# EAGLE design mm5833 (EAGLE 9.6.2)
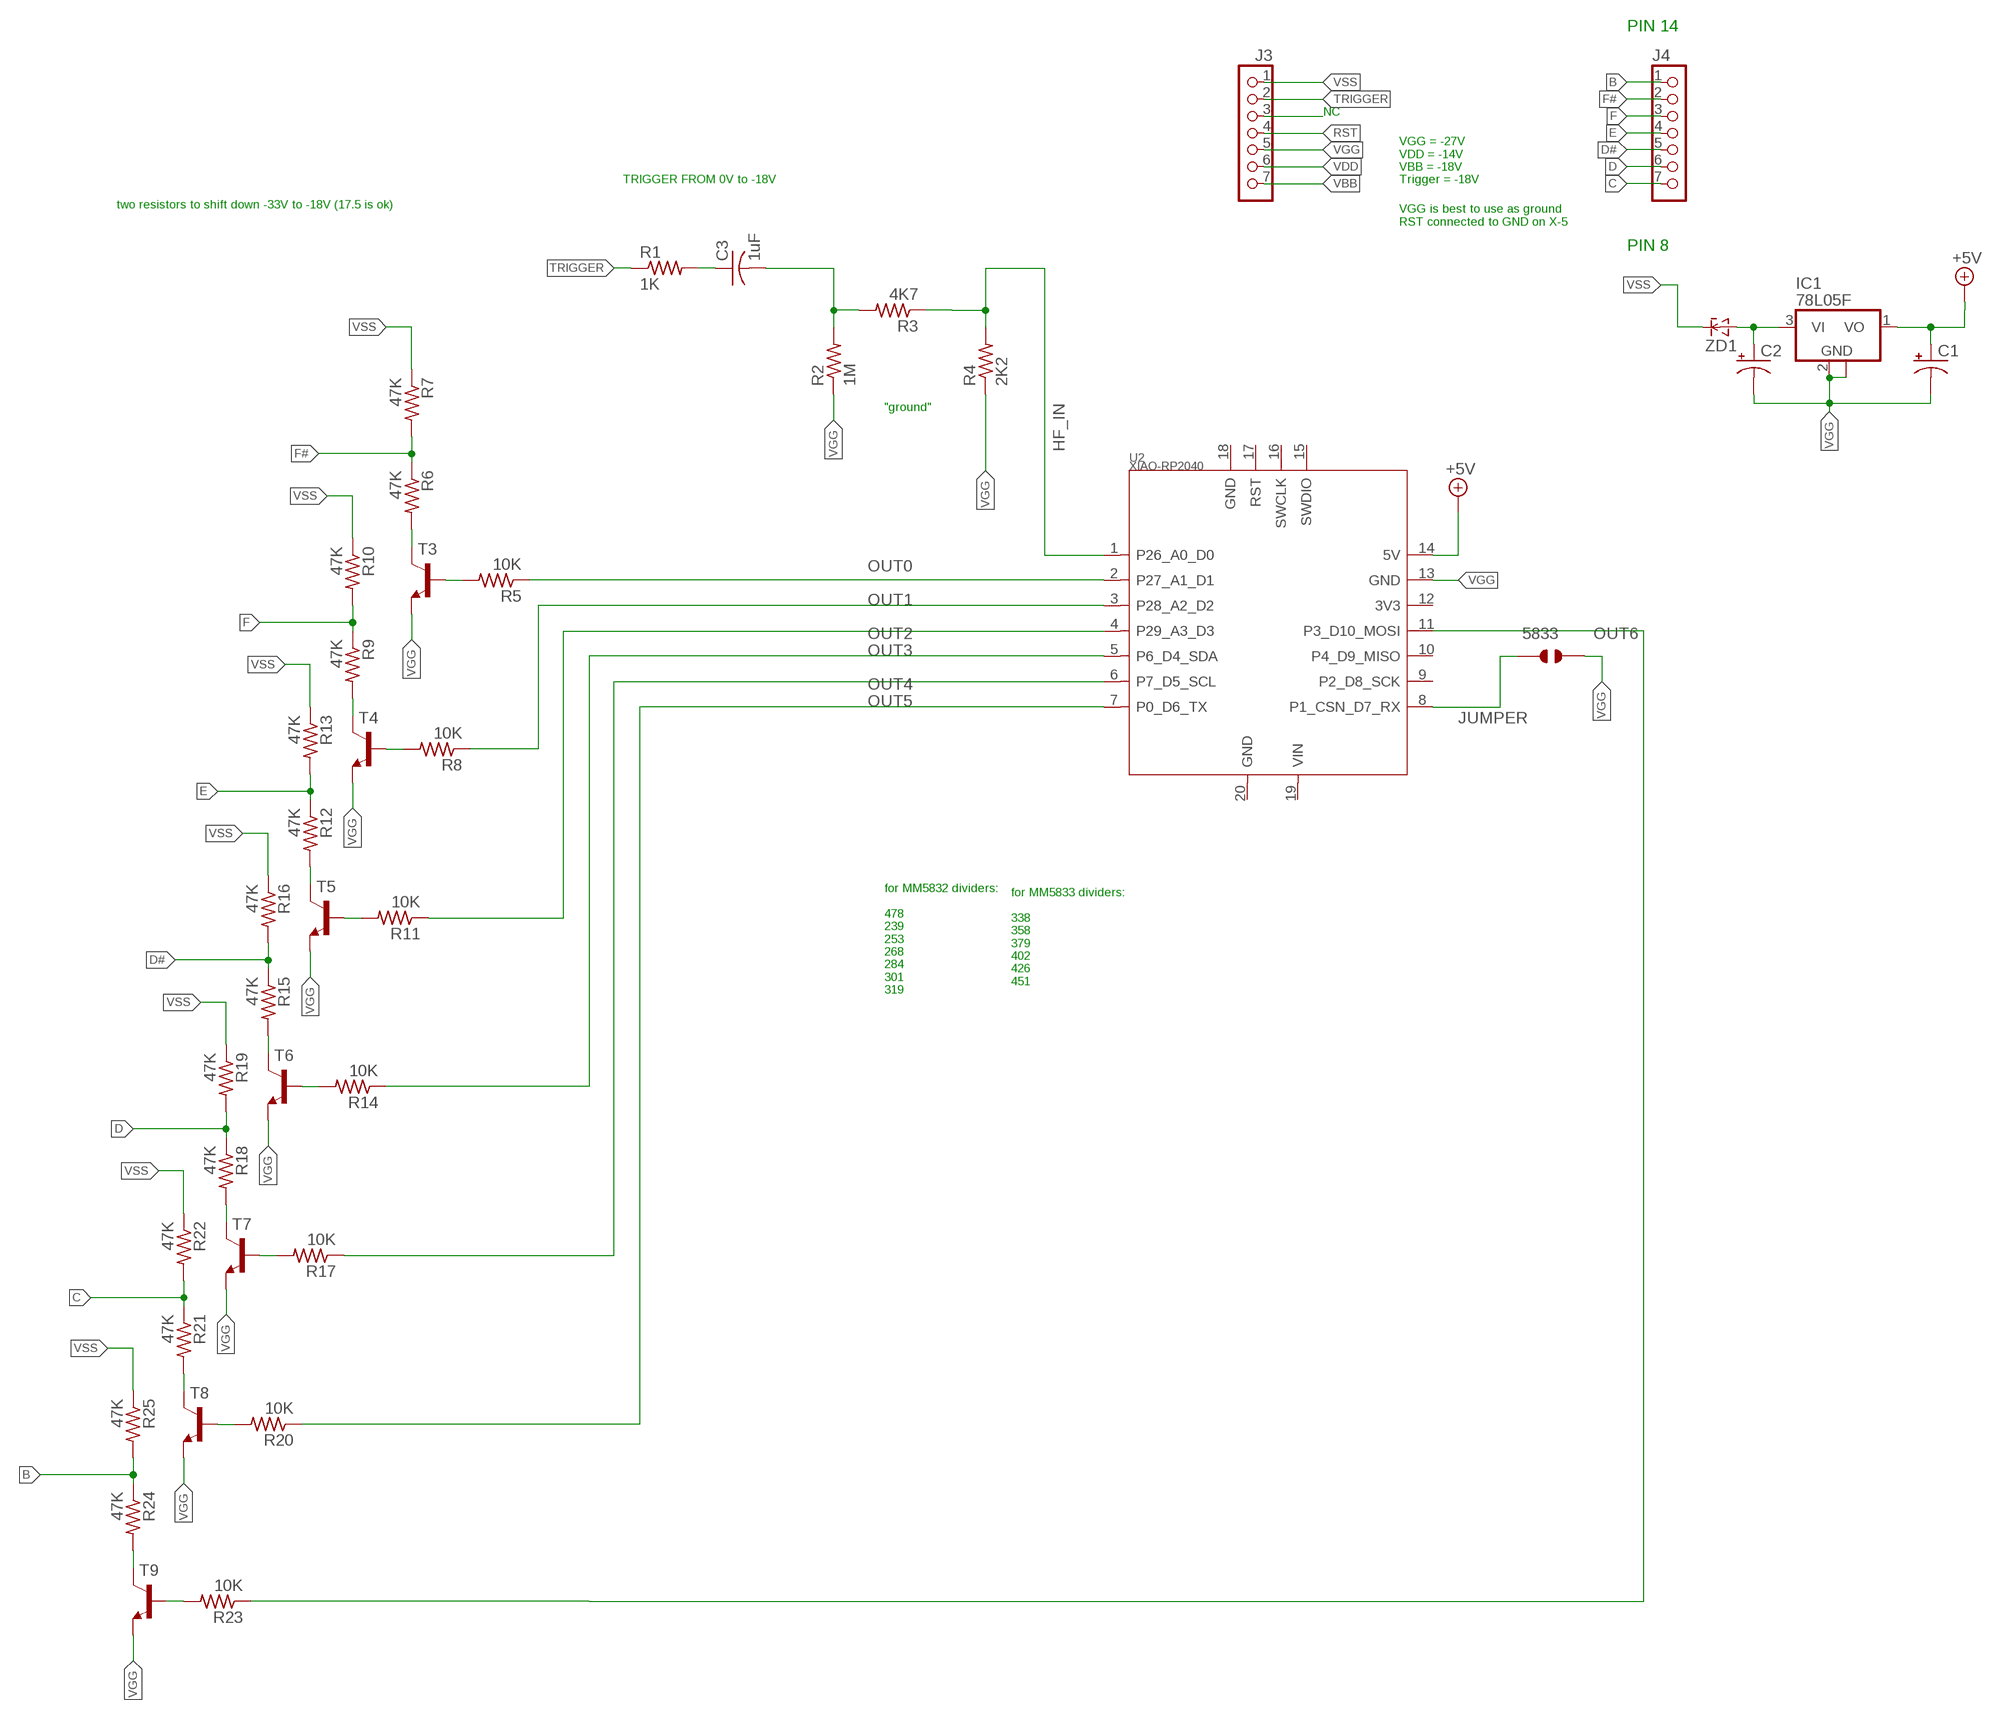
[diagram p0: schematic, sheet 1]

## Parts
5833  JUMPER_SOLDER_1X2  [JUMPER_SOLDER_1X2]
C1  CPOL-USA/3216-18R  [A/3216-18R]
C2  CPOL-USA/3216-18R  [A/3216-18R]
C3  1uF  C-USC0805  [C0805]
IC1  78L05F  [SOT89]
J3  CON_HEADER_1X07  [M1X7_SMD]
J4  CON_HEADER_1X07  [M1X7_SMD]
R1  1K  R-US_R0603  [R0603]
R2  1M  R-US_R0603  [R0603]
R3  4K7  R-US_R0603  [R0603]
R4  2K2  R-US_R0603  [R0603]
R5  10K  R-US_R0603  [R0603]
R6  47K  R-US_R0603  [R0603]
R7  47K  R-US_R0603  [R0603]
R8  10K  R-US_R0603  [R0603]
R9  47K  R-US_R0603  [R0603]
R10  47K  R-US_R0603  [R0603]
R11  10K  R-US_R0603  [R0603]
R12  47K  R-US_R0603  [R0603]
R13  47K  R-US_R0603  [R0603]
R14  10K  R-US_R0603  [R0603]
R15  47K  R-US_R0603  [R0603]
R16  47K  R-US_R0603  [R0603]
R17  10K  R-US_R0603  [R0603]
R18  47K  R-US_R0603  [R0603]
R19  47K  R-US_R0603  [R0603]
R20  10K  R-US_R0603  [R0603]
R21  47K  R-US_R0603  [R0603]
R22  47K  R-US_R0603  [R0603]
R23  10K  R-US_R0603  [R0603]
R24  47K  R-US_R0603  [R0603]
R25  47K  R-US_R0603  [R0603]
T3  MMBT3904LT1-NPN-SOT23-BEC  [SOT23-BEC]
T4  MMBT3904LT1-NPN-SOT23-BEC  [SOT23-BEC]
T5  MMBT3904LT1-NPN-SOT23-BEC  [SOT23-BEC]
T6  MMBT3904LT1-NPN-SOT23-BEC  [SOT23-BEC]
T7  MMBT3904LT1-NPN-SOT23-BEC  [SOT23-BEC]
T8  MMBT3904LT1-NPN-SOT23-BEC  [SOT23-BEC]
T9  MMBT3904LT1-NPN-SOT23-BEC  [SOT23-BEC]
U2  XIAO-RP2040  [XIAO-SAMD21/RP2040-MODULE14P-2.54-21X17.8MM]
ZD1  ZENERSOD-123  [SOD-123]

## Nets
+5V: C1.+ IC1.1(VO) U2.14(5V)
B: J4.1 R24.1 R25.2
C: J4.7 R21.1 R22.2
D: J4.6 R18.1 R19.2
D#: J4.5 R15.1 R16.2
E: J4.4 R12.1 R13.2
F: J4.3 R9.1 R10.2
F#: J4.2 R6.1 R7.2
HF_IN: R3.1 R4.2 U2.1(P26_A0_D0)
JUMPER: 5833.1 U2.8(P1_CSN_D7_RX)
N$1: C2.+ IC1.3(VI) ZD1.A
N$2: C3.1 R1.2
N$3: C3.2 R2.2 R3.2
N$5: J3.3
N$9: R5.2 T3.B
N$11: R6.2 T3.C
N$12: R8.2 T4.B
N$13: R24.2 T9.C
N$14: R9.2 T4.C
N$15: R11.2 T5.B
N$17: R12.2 T5.C
N$18: R14.2 T6.B
N$19: R23.2 T9.B
N$20: R15.2 T6.C
N$21: R17.2 T7.B
N$23: R18.2 T7.C
N$24: R20.2 T8.B
N$26: R21.2 T8.C
OUT0: R5.1 U2.2(P27_A1_D1)
OUT1: R8.1 U2.3(P28_A2_D2)
OUT2: R11.1 U2.4(P29_A3_D3)
OUT3: R14.1 U2.5(P6_D4_SDA)
OUT4: R17.1 U2.6(P7_D5_SCL)
OUT5: R20.1 U2.7(P0_D6_TX)
OUT6: R23.1 U2.11(P3_D10_MOSI)
RST: J3.4
TRIGGER: J3.2 R1.1
VBB: J3.7
VDD: J3.6
VGG: 5833.2 C1.- C2.- IC1.2(GND) IC1.2@1(GND) J3.5 R2.1 R4.1 T3.E T4.E T5.E T6.E T7.E T8.E T9.E U2.13(GND)
VSS: J3.1 R7.1 R10.1 R13.1 R16.1 R19.1 R22.1 R25.1 ZD1.C
Unconnected: U2.9(P2_D8_SCK) U2.10(P4_D9_MISO) U2.12(3V3) U2.15(SWDIO) U2.16(SWCLK) U2.17(RST) U2.18(GND) U2.19(VIN) U2.20(GND)

## Notes on the sheet
- PIN 14
- NC
- TRIGGER FROM 0V to -18V
- VGG = -27V
  VDD = -14V
  VBB = -18V
  Trigger = -18V
- two resistors to shift down -33V to -18V (17.5 is ok)
- VGG is best to use as ground
  RST connected to GND on X-5
- PIN 8
- "ground"
- for MM5833 dividers:
  
  338
  358
  379
  402
  426
  451
- for MM5832 dividers:
  
  478
  239
  253
  268
  284
  301
  319

## Library data of the parts
5833 = dp_devices:JUMPER_SOLDER_1X2
C1 C2 = rcl:CPOL-US: POLARIZED CAPACITOR, American symbol; SPICEPREFIX: C
C3 = rcl:C-US: CAPACITOR, American symbol; SPICEPREFIX: C
IC1 = linear:78L*: POSITOIV-VOLTAGE REGULATORS Output up to 100 mA Source: Datasheet <http://focus.ti.com/lit/ds/symlink/ua78l05.pdf>
J3 J4 = ptrz:CON_HEADER_1X07
R1-R25 = rcl:R-US_: RESISTOR, American symbol; SPICEPREFIX: R
T3-T9 = transistor:*-NPN-: NPN Transistror BF959 corrected 2008.03.06
U2 = Seeed Studio XIAO Series:XIAO-RP2040: Seeed Studio XIAO RP2040 v1.22 - Raspberry Pi RP2040 Microcontroller - 32-bit 133MHz Dual-Core ARM® Cortex® M0+processor Seeed SKU: 102010428 Seeed Studio XIAO RP2040 is a microcontroller using the Raspberry Pi RP2040 chip. The MCU runs at up to 133MHz. It is built with rich interfaces in a tiny thumb size and fully supports Arduino, MicroPython, and CircuitPython. The onboard interfaces are enough for developing multiple applications. Buy now <https://www.seeedstudio.com/XIAO-RP2040-v1-0-p-5026.html> Wiki <https://wiki.seeedstudio.com/XIAO-RP2040/>
ZD1 = dp_devices:ZENER: Zener Diode SOD-323

## Net classes
0 default: width 0.254 mm, drill 0.254 mm, clearance 0.178 mm

## Board
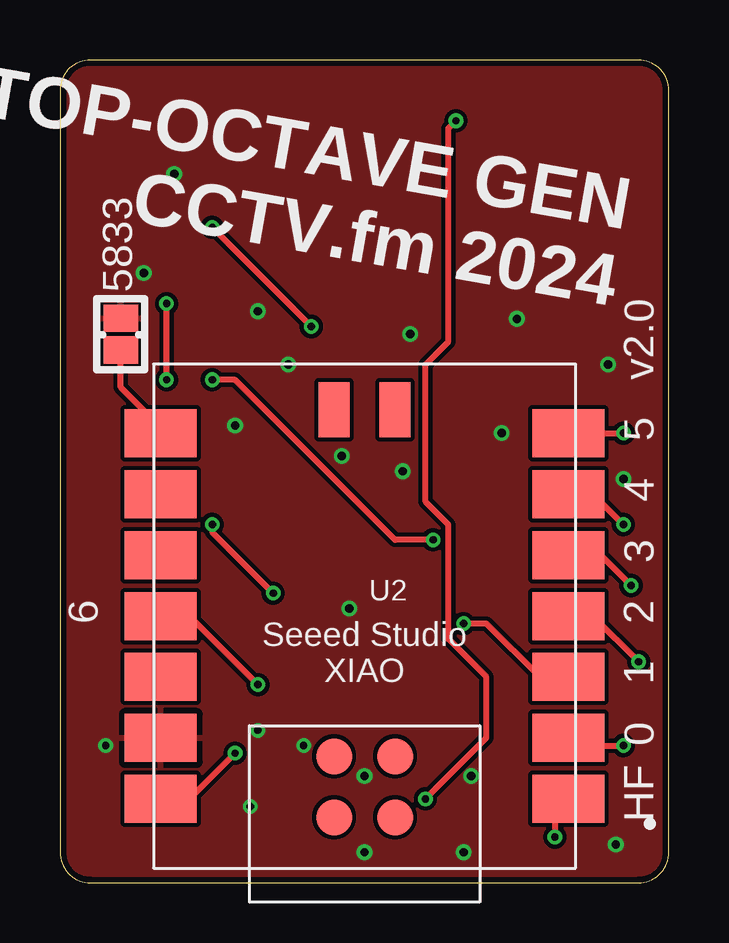
[diagram p1: board, top side]
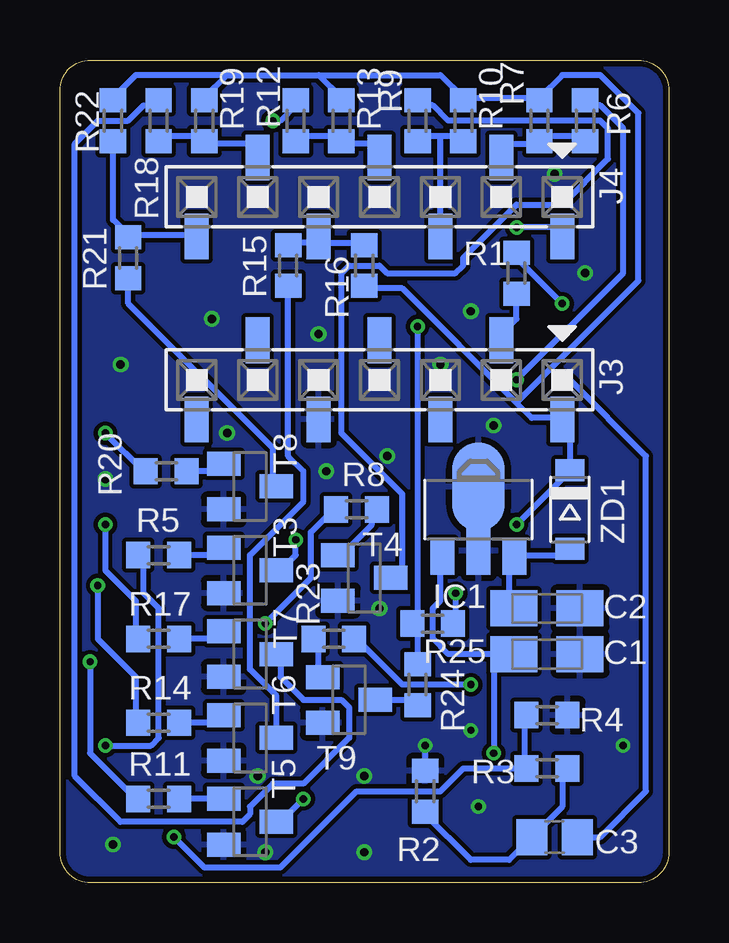
[diagram p2: board, bottom side, seen from below]

Size 25.39 x 34.28 mm. Coordinates in mm from the lower left corner, seen from the top.
Outline: 0,33.01 0,1.27 arc90 1.27,0 24.12,0 arc90 25.39,1.27 25.39,33.01 arc90 24.12,34.28 1.27,34.28 arc90 0,33.01
Copper layers (1*16): Top 0.035mm / dielectric 1.5mm / Bottom 0.035mm
Design rules "dirt_cheap_dirty_boards.v1": minimum track width 5mil, minimum drill 12mil, track to track 5mil, track to pad 5mil, pad to pad 5mil, via to via 5mil, smd to smd 0mil, copper to edge 10mil, drill to drill 10mil, minimum pad ring 10mil, minimum via ring 6mil, stop-mask expansion 2mil, vias tented up to drill 25mil, thermal gap 10mil

### Footprints (pad centres in the part's own frame; a part is rotated, then mirrored left to right if it is on the bottom)
JUMPER_SOLDER_1X2 = smd 1.143 x 1.422: 1 -0.66,0; 2 0.66,0
A/3216-18R = smd 1.95 x 1.5: + 1.375,0; - -1.375,0
C0805 = smd 1.3 x 1.5: 1 -0.95,0; 2 0.95,0
SOT89 = smd 1 x 1.5: 1 -1.499,-1.981; 3 1.499,-1.981 | smd 1 x 2: 2 0,-1.727 | smd 2.2 x 3.7: 2@1 0,0.94
M1X7_SMD = smd 1 x 1.9: 1 -8.89,1.65; 2 -6.35,-1.65; 3 -3.81,1.65; 4 -1.27,-1.65; 5 1.27,1.65; 6 3.81,-1.65; 7 6.35,1.65
R0603 = smd 1 x 1.1: 1 -0.85,0; 2 0.85,0
SOT23-BEC = smd 1 x 1.4: B -0.95,-1.1; C 0,1.1; E 0.95,-1.1
XIAO-SAMD21/RP2040-MODULE14P-2.54-21X17.8MM = smd 3 x 2: 1 -8.5,7.62; 2 -8.5,5.08; 3 -8.5,2.54; 4 -8.5,0; 5 -8.5,-2.54; 6 -8.5,-5.08; 7 -8.5,-7.62; 8 8.5,-7.62; 9 8.5,-5.08; 10 8.5,-2.54; 11 8.5,0; 12 8.5,2.54; 13 8.5,5.08; 14 8.5,7.62 | smd 1.5 x 1.5: 15 -1.27,8.39; 16 1.27,8.39; 17 -1.27,5.85; 18 1.27,5.85 | smd 1.3 x 2.3: 19 -1.27,-8.6; 20 1.27,-8.6
SOD-123 = smd 0.91 x 1.22: A 1.635,0; C -1.635,0

### Placement (x,y rotation side)
5833  2.54,22.86 90 top
C1  5.08,9.53 180 bottom
C2  5.08,11.43 180 bottom
C3  4.76,1.91 180 bottom
IC1  7.94,15.56 0 bottom
J3  13.34,20.96 180 bottom
J4  13.34,28.57 180 bottom
R1  6.35,25.4 90 bottom
R2  10.16,3.81 270 bottom
R3  5.08,4.76 0 bottom
R4  5.08,6.99 180 bottom
R5  21.27,13.65 0 bottom
R6  3.49,31.75 90 bottom
R7  5.4,31.75 270 bottom
R8  13.02,15.56 0 bottom
R9  10.48,31.75 90 bottom
R10  8.57,31.75 270 bottom
R11  21.27,3.49 0 bottom
R12  15.56,31.75 90 bottom
R13  13.65,31.75 270 bottom
R14  21.27,6.67 0 bottom
R15  15.88,25.72 270 bottom
R16  12.7,25.72 90 bottom
R17  21.27,10.16 0 bottom
R18  21.27,31.75 90 bottom
R19  19.37,31.75 270 bottom
R20  20.95,17.14 0 bottom
R21  22.54,26.04 270 bottom
R22  23.18,31.75 270 bottom
R23  13.97,10.16 180 bottom
R24  10.48,8.26 270 bottom
R25  9.84,10.79 180 bottom
T3  17.46,13.02 270 bottom
T4  12.7,12.7 270 bottom
T5  17.46,2.54 270 bottom
T6  17.46,6.03 270 bottom
T7  17.46,9.53 270 bottom
T8  17.46,16.51 270 bottom
T9  13.34,7.62 270 bottom
U2  12.7,11.11 180 top
ZD1  4.13,15.56 270 bottom

### Tracks (layer width: path | path; a pad name or v marks a point on that pad's centre or on a via)
+5V  (via drill 0.3)
  Top 0.254: v7.3,5.4 5.4,3.49 4.45,3.49 U2.14
  Bottom 0.254: 7.3,9.53 6.67,9.53 C1.+ 7.3,9.53 | 7.3,9.53 9.21,9.53 9.84,10.16 9.84,11.43 9.53,11.75 9.53,13.34 IC1.1 | 7.3,9.53 v7.3,5.4
B  (via drill 0.3)
  Top 0.254: v6.35,27.3 v10.48,23.18
  Bottom 0.254: 10.48,10.79 10.48,9.21 R24.1 | 10.48,10.79 R25.2 10.48,10.79 | v10.48,23.18 10.48,10.79 | v6.35,27.3 4.76,27.3 4.45,26.99 J4.1
C
  Bottom 0.254: 22.54,26.99 19.68,26.99 J4.7 | 22.54,26.99 R21.1 22.54,26.99 | 22.54,26.99 23.18,27.62 23.18,30.8 R22.2
D
  Bottom 0.254: R18.1 21.27,31.12 19.37,31.12 R19.2 19.37,30.8 17.46,30.8 17.14,30.48 J4.6
D#
  Bottom 0.254: 14.61,26.67 12.7,26.67 R16.2 | 14.61,26.67 J4.5 14.61,26.67 | 14.61,26.67 15.88,26.67 R15.1
E
  Bottom 0.254: R12.1 15.56,31.12 13.65,31.12 R13.2 13.65,30.8 12.38,30.8 12.07,30.48 J4.4
F
  Bottom 0.254: 9.53,31.12 10.48,31.12 R9.1 | 9.53,31.12 8.57,31.12 R10.2 | 9.53,31.12 9.53,26.99 J4.3
F#
  Bottom 0.254: R6.1 3.49,31.12 5.4,31.12 R7.2 5.4,30.8 6.67,30.8 6.99,30.48 J4.2
HF_IN  (via drill 0.3)
  Top 0.254: v20.64,1.91 20.64,3.17 20.95,3.49 U2.1
  Bottom 0.254: 6.03,4.76 6.03,6.99 R4.2 | 6.03,4.76 R3.1 6.03,4.76 | 6.03,4.76 8.57,4.76 9.53,3.81 13.02,3.81 16.19,0.63 19.37,0.63 v20.64,1.91
JUMPER
  Top 0.254: 5833.1 2.54,21.91 2.54,20.64 4.45,18.73 U2.8
N$1
  Bottom 0.254: ZD1.A 4.13,13.65 6.35,13.65 IC1.3 6.67,13.34 6.67,11.43 C2.+
N$2  (via drill 0.3)
  Top 0.254: v4.45,20.96 v4.45,24.13
  Bottom 0.254: v4.45,24.13 6.35,26.04 R1.2 | v4.45,20.96 4.13,20.96 0.95,17.78 0.95,3.81 2.86,1.91 C3.1
N$3
  Bottom 0.254: R3.2 4.45,4.76 4.45,3.17 C3.2 | C3.2 5.71,2.22 C3.2 | R2.2 10.16,2.86 8.25,0.95 6.67,0.95 C3.2
N$9
  Bottom 0.254: R5.2 20.32,13.65 18.73,13.65 T3.B
N$11  (via drill 0.3)
  Top 0.254: v6.35,20.96 7.3,20.96 13.97,14.29 v15.56,14.29
  Bottom 0.254: v6.35,20.96 1.91,25.4 1.91,31.43 2.86,32.38 3.49,32.38 R6.2 | v15.56,14.29 15.56,13.65 16.19,13.02 T3.C
N$12
  Bottom 0.254: R8.2 12.38,15.56 12.38,14.92 13.65,13.65 T4.B
N$13
  Bottom 0.254: R24.2 10.48,7.62 12.07,7.62 T9.C
N$14
  Bottom 0.254: R9.2 10.48,32.38 9.84,32.38 9.21,31.75 2.86,31.75 2.54,31.43 2.54,30.16 4.45,28.26 6.35,28.26 8.57,26.04 8.57,25.72 8.89,25.4 11.75,25.4 12.07,25.72 13.34,25.72 13.65,25.4 13.65,18.73 11.11,16.19 11.11,13.02 11.43,12.7 T4.C
N$15
  Bottom 0.254: R11.2 20.32,3.49 18.73,3.49 T5.B
N$17  (via drill 0.3)
  Top 0.254: v16.51,31.75 16.19,31.43 16.19,22.54 15.24,21.59 15.24,15.88 16.19,14.92 16.19,10.16 17.78,8.57 17.78,6.03 v15.24,3.49
  Bottom 0.254: v16.51,31.75 16.19,31.75 15.56,32.38 R12.2 | v15.24,3.49 16.19,2.54 T5.C
N$18
  Bottom 0.254: R14.2 20.32,6.67 18.73,6.67 T6.B
N$19
  Bottom 0.254: R23.2 14.61,10.16 14.61,8.57 T9.B
N$20
  Bottom 0.254: T6.C 16.36,7.79 17.46,8.89 17.46,13.65 15.24,15.88 15.24,17.14 15.88,17.78 15.88,24.77 R15.2
N$21
  Bottom 0.254: R17.2 20.32,10.16 18.73,10.16 T7.B
N$23
  Bottom 0.254: R18.2 21.27,32.38 21.91,32.38 22.54,31.75 23.81,31.75 24.77,30.8 24.77,4.45 22.86,2.54 17.78,2.54 17.46,2.86 17.46,3.17 16.51,4.13 15.24,4.13 13.34,6.03 13.34,7.3 13.65,7.62 15.24,7.62 16.19,8.57 16.19,9.53 T7.C
N$24
  Bottom 0.254: R20.2 20,17.14 18.73,17.14 T8.B
N$26
  Bottom 0.254: R21.2 22.54,25.08 22.54,24.13 16.51,18.1 16.51,16.51 T8.C
OUT0  (via drill 0.3)
  Top 0.254: v23.49,5.71 21.59,5.71 21.27,6.03 U2.2
  Bottom 0.254: v23.49,5.71 21.59,5.71 21.27,6.03 21.27,11.43 21.91,12.07 21.91,13.65 R5.1
OUT1  (via drill 0.3)
  Top 0.254: v16.83,10.79 17.78,10.79 20,8.57 20.95,8.57 U2.3
  Bottom 0.254: v16.83,10.79 14.92,12.7 14.92,14.61 13.97,15.56 R8.1
OUT2  (via drill 0.3)
  Top 0.254: v24.13,9.21 22.22,11.11 21.27,11.11 U2.4
  Bottom 0.254: v24.13,9.21 24.13,5.4 22.22,3.49 R11.1
OUT3  (via drill 0.3)
  Top 0.254: v23.81,12.38 22.54,13.65 21.27,13.65 U2.5
  Bottom 0.254: v23.81,12.38 23.81,10.16 22.22,8.57 22.22,6.67 R14.1
OUT4  (via drill 0.3)
  Top 0.254: v23.49,14.92 22.22,16.19 21.27,16.19 U2.6
  Bottom 0.254: v23.49,14.92 23.49,13.02 22.22,11.75 22.22,10.16 R17.1
OUT5  (via drill 0.3)
  Top 0.254: v23.49,18.73 21.27,18.73 U2.7
  Bottom 0.254: v23.49,18.73 21.91,17.14 R20.1
OUT6  (via drill 0.3)
  Top 0.254: v8.25,8.26 5.4,11.11 4.45,11.11 U2.11
  Bottom 0.254: v8.25,8.26 11.11,8.26 13.02,10.16 R23.1
TRIGGER
  Bottom 0.254: R1.1 6.35,24.45 6.35,23.5 6.99,22.86 J3.2
VGG  (via drill 0.3, 0.35)
  Bottom 0.254: v10.16,5.71 10.16,4.76 R2.1
  other vias: 7.3,19.05 9.53,21.59 8.25,23.81 14.61,22.86 19.05,23.5 22.86,21.59 18.41,18.73 23.49,16.83 14.29,17.14 12.07,11.43 8.25,6.35 12.7,4.45 12.7,1.27 17.14,4.45 23.18,1.59 7.94,3.17 1.91,5.71 16.83,1.27 11.75,17.78 4.76,29.53 3.49,25.4
  pour Top: 24.13,0 1.27,0 arc-90 0,1.27 0,33.02 arc-90 1.27,34.29 24.13,34.29 arc-90 25.4,33.02 25.4,1.27 arc-90
  pour Bottom: 24.13,0 1.27,0 arc-90 0,1.27 0,33.02 arc-90 1.27,34.29 24.13,34.29 arc-90 25.4,33.02 25.4,1.27 arc-90
VSS  (via drill 0.3)
  Top 0.254: v8.89,12.07 6.35,14.61 v6.35,14.92
  Bottom 0.254: 8.57,32.7 5.4,32.7 | 5.4,32.7 R7.1 5.4,32.7 | 8.57,32.7 R10.1 8.57,32.7 | 14.61,33.66 13.65,32.7 R13.1 | 18.41,33.66 14.61,33.66 | 18.41,33.66 19.37,32.7 R19.1 | 18.41,33.66 22.22,33.66 23.18,32.7 R22.1 | 8.57,32.7 9.53,33.66 14.61,33.66 | v8.89,12.07 8.89,10.79 R25.1 | v6.35,14.92 4.13,17.14 ZD1.C 4.13,17.46 4.13,18.73 4.45,19.05 J3.1 4.45,19.37 5.71,19.37 6.35,20 | 6.35,20 11.11,24.77 12.7,24.77 R16.1 | 5.4,32.7 4.45,33.66 2.86,33.66 1.27,32.07 1.27,25.08 6.35,20

### Text on the board
tNames: TOP-OCTAVE GEN / CCTV.fm 2024 | v2.0 | 5 | 4 | 3 | 6 | 2 | 1 | 0 | HF